# Altium schematic sheet Accelerometer.SchDoc
size A; SheetNumber: 3; SheetTotal: 6
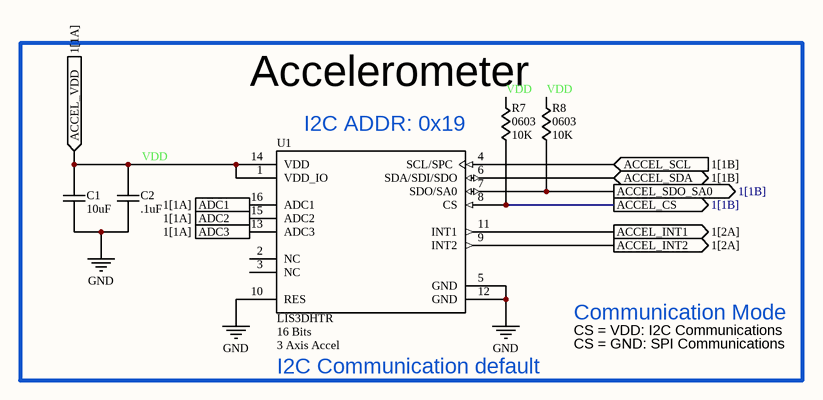
[diagram p0: Accelerometer.SchDoc]

## Parts
C1  value 10uF  [PCB-CAP-SMD-0603]  (hidden comment: CAP-SMD-0603)
C2  value .1uF  [PCB-CAP-SMD-0603]  (hidden comment: CAP-SMD-0603)
R7  value 10K  Footprint: 0603  [PCB-RES-SMD-0603]  (hidden comment: RES-SMD-0603)
R8  value 10K  Footprint: 0603  [PCB-RES-SMD-0603]  (hidden comment: RES-SMD-0603)
U1  Resolution: 16 Bits  Part Number: LIS3DHTR  Sensor Type: 3 Axis Accel  [PCB-LGA16_3X3MM]  (hidden comment: SEN-ACCEL-16BIT-LIS3DHTR)

## Ports
ACCEL_CS (out, see 1[1B]), ACCEL_INT1 (out, see 1[2A]), ACCEL_INT2 (out, see 1[2A]), ACCEL_SCL (in, see 1[1B]), ACCEL_SDA (bidir, see 1[1B]), ACCEL_SDO_SA0 (out, see 1[1B]), ACCEL_VDD (in, see 1[1A]), ADC1 (in, see 1[1A]), ADC2 (in, see 1[1A]), ADC3 (in, see 1[1A])

## Nets
GND: C1.2 C2.2 U1.5(GND) U1.10(RES) U1.12(GND)
ACCEL_CS: R7.1 U1.8(CS) ; port ACCEL_CS
ACCEL_INT1: U1.11(INT1) ; port ACCEL_INT1
ACCEL_INT2: U1.9(INT2) ; port ACCEL_INT2
ACCEL_SCL: U1.4(SCL/SPC) ; port ACCEL_SCL
ACCEL_SDA: U1.6(SDA/SDI/SDO) ; port ACCEL_SDA
ACCEL_SDO_SA0: R8.1 U1.7(SDO/SA0) ; port ACCEL_SDO_SA0
ADC1: U1.16(ADC1) ; port ADC1
ADC2: U1.15(ADC2) ; port ADC2
ADC3: U1.13(ADC3) ; port ADC3
VDD: C1.1 C2.1 R7.2 R8.2 U1.1(VDD_IO) U1.14(VDD) ; port ACCEL_VDD

Not connected (* = marked no-connect by the designer): U1 2(NC) 3(NC)

## Notes on the sheet
- (near R7) Accelerometer
- (near U1) I2C ADDR: 0x19
- I2C Communication default
- Communication Mode
- CS = VDD: I2C Communications
- CS = GND: SPI Communications

## Library data of the parts
C1 C2 = CMP-00006-5: Generic (no part number) 0603 surface mount capacitor
R7 R8 = CMP-00002-4: Generic (no part number) 0603 surface mount resistor
U1 = CMP-062-000000-3: LIS3DHTR 3-Axis Accelerometer with I2C/SPI Interface    VDD: 1.71-3.6V  VDDIO: 1.71-VDD+0.1V  Scale: +/-2g, 4g, 8g, 16g with 16--bit data output  Temp:: -40Â°C - 85Â°C       Mouser: 511-LIS3DHTR Digikey: 497-10613-1-ND; Operating Supply Voltage: 2.5V; Axis: X, Y, Z; Operating Supply Current: 11uA; Interface: I2C,SPI; Max Supply Voltage (DC): 3.6V; Output Type: Digital; Bandwidth: 5kHz; Min Supply Voltage (DC): 1.71V; Max Operating Temperature: 85°C; Pins: 16; Height: 1mm; Depth: 3mm; Length: 3mm; Radiation Hardening: No; Lead Free: Lead Free; Min Operating Temperature: -40°C; RoHS Compliant: Yes; Packaging: Tape and Reel; Package Quantity: 4000; Series: -; Width: 3mm; Max Supply Voltage: 3.6V; Reach SVHC Compliant: No; Case/Package: LGA; Min Supply Voltage: 1.71V